# Altium project Assignment2.PrjPcb (part 1 of 2)
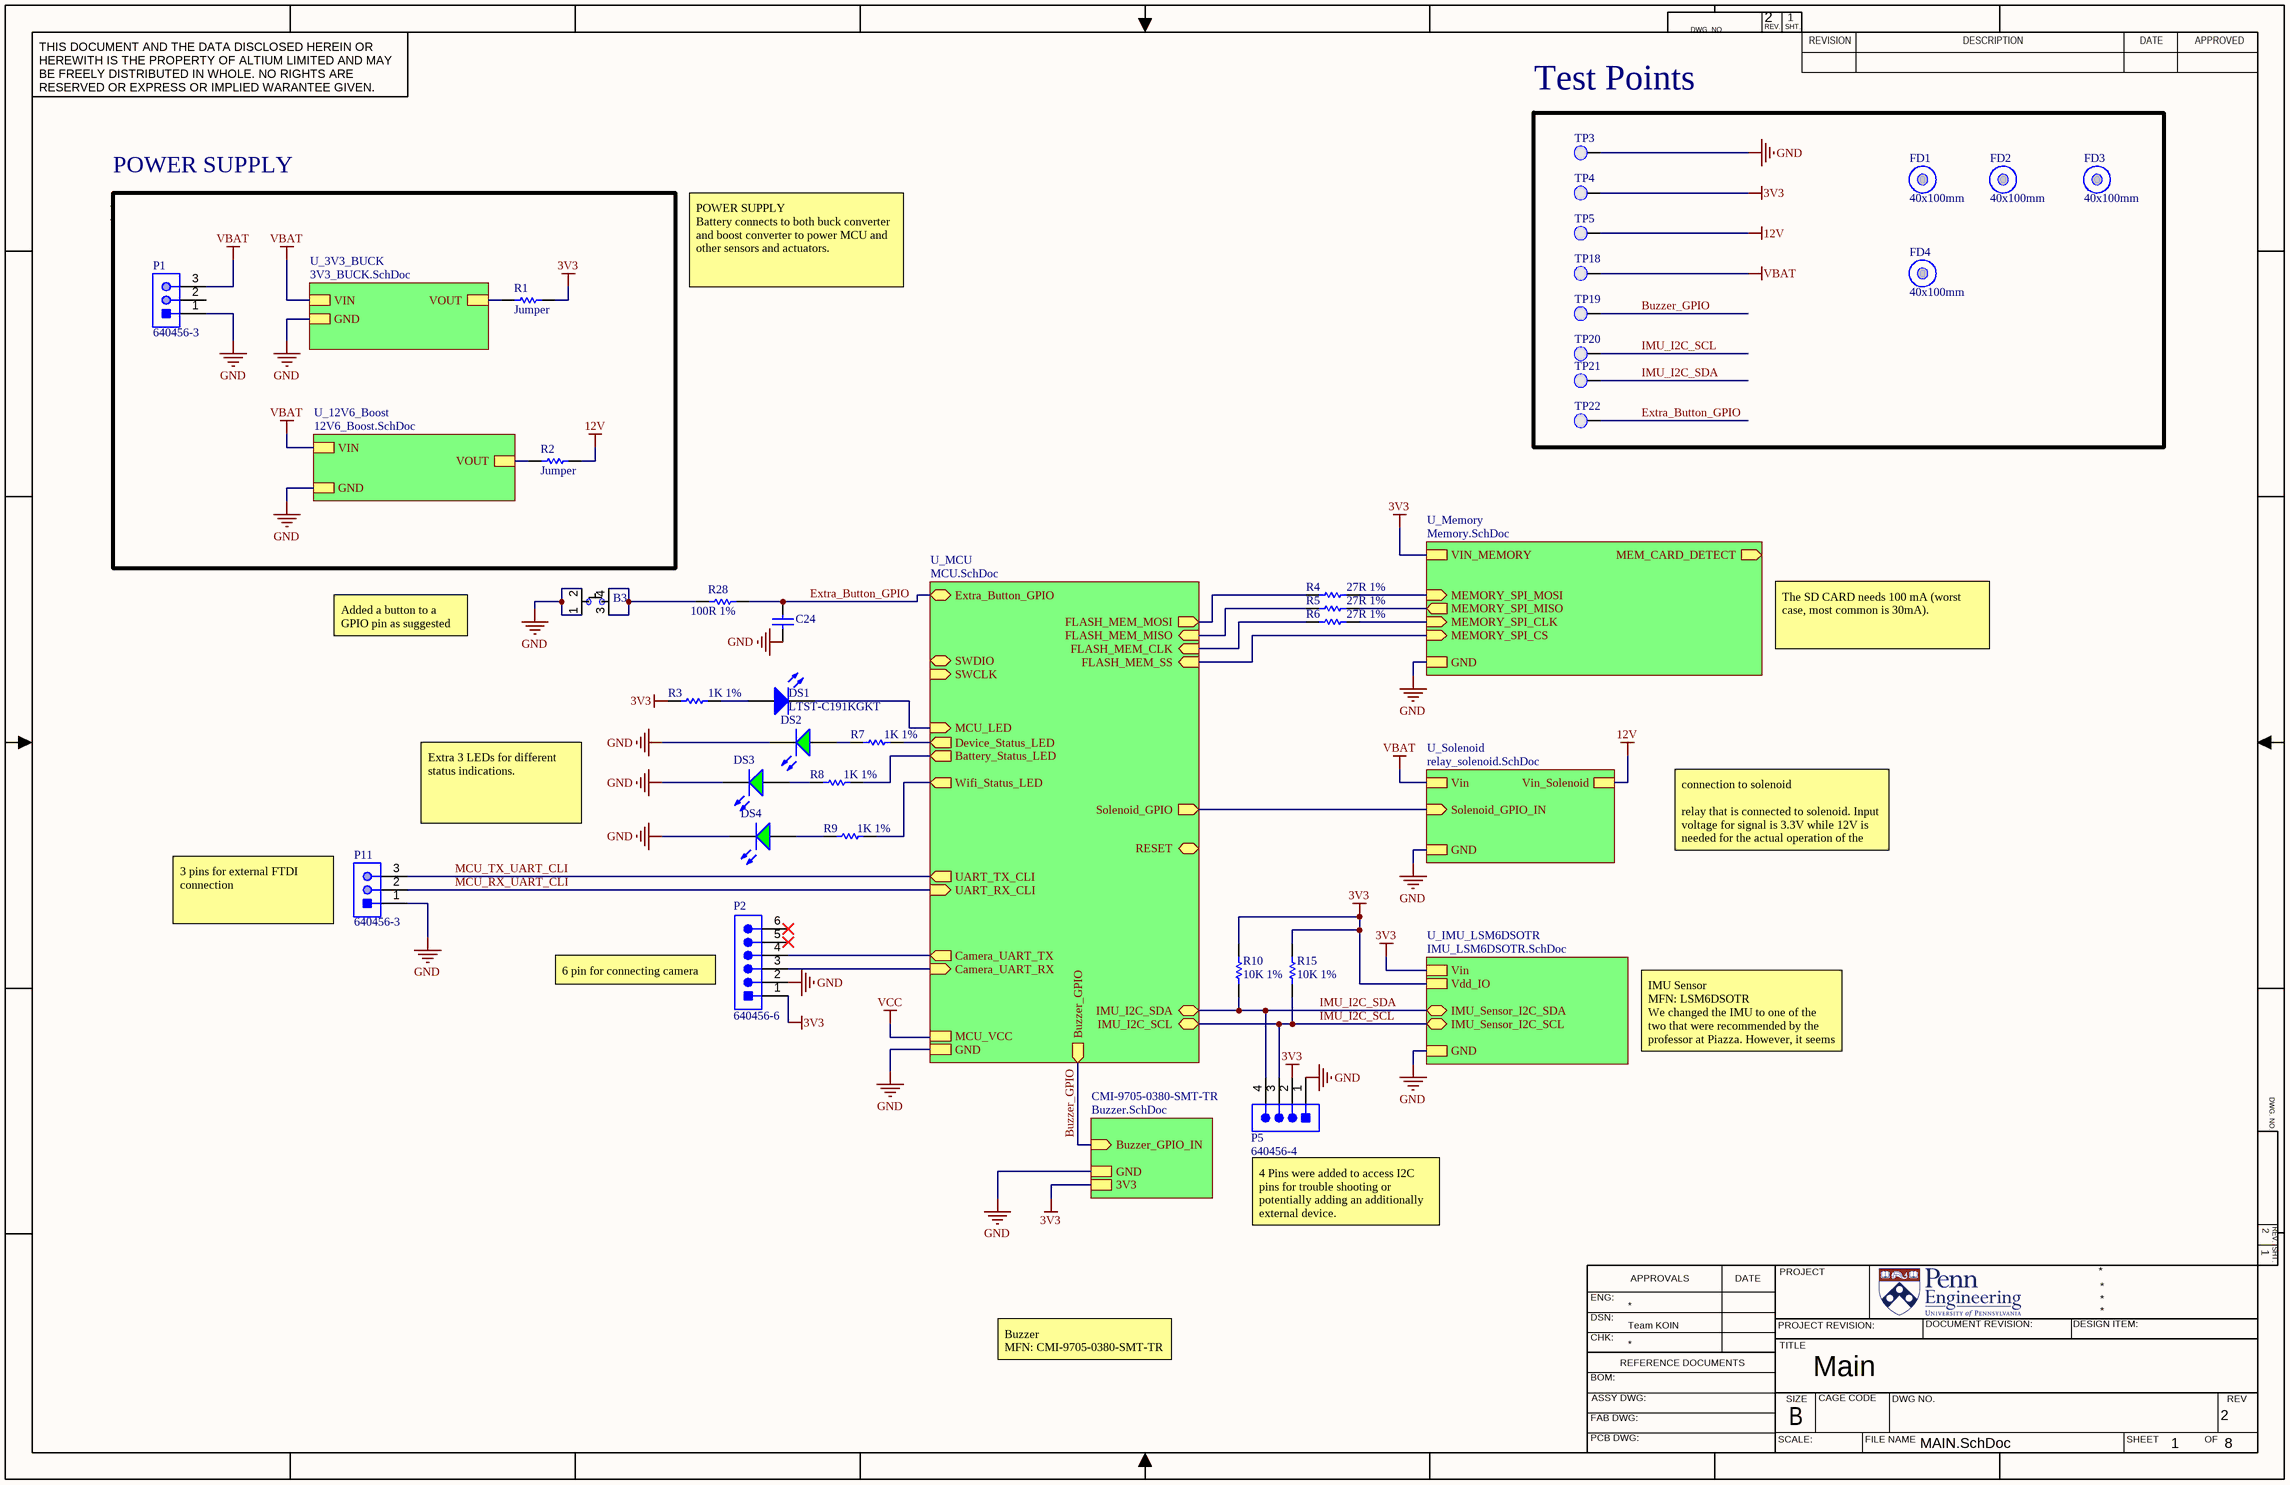
[diagram p0: MAIN.SchDoc]
8 sheets, 107 parts. Net scope: strictly hierarchical (ports join the sheet entries above them; power ports are local).
Board file: ESE516_PCB.PcbDoc
Sheets:
  MAIN.SchDoc
    U_MCU = MCU.SchDoc
    U_Memory = Memory.SchDoc
    U_3V3_BUCK = 3V3_BUCK.SchDoc
    U_12V6_Boost = 12V6_Boost.SchDoc
    U_Solenoid = relay_solenoid.SchDoc
    U_IMU_LSM6DSOTR = IMU_LSM6DSOTR.SchDoc
    CMI-9705-0380-SMT-TR = Buzzer.SchDoc

## Sheet MAIN.SchDoc: Main
size 431 x 279 mm; Date: 02/15/2021; CompanyName: University of Pennsylvania; DrawnBy: Team KOIN; DocumentNumber: 1; Revision: 2; SheetNumber: 1; SheetTotal: 8

### Parts
B3  PTS810 SJK 250 SMTR LFS  [PTS810 SJK 250 SMTR LFS]  (value not drawn)
C24  CAP 1uF 16V 0603(1608)  [CAPC0603(1608)100_N]  (value not drawn)
DS1  LTST-C191KGKT  [LITE-ON-LTST-C191KRKT-2_V]
DS2  (no value)  [LTST-C170GKT_V]
DS3  (no value)  [LTST-C170GKT_V]
DS4  (no value)  [LTST-C170GKT_V]
FD1  40x100mm  [Fiducial_FT]
FD2  40x100mm  [Fiducial_FT]
FD3  40x100mm  [Fiducial_FT]
FD4  40x100mm  [Fiducial_FT]
P1  640456-3  [TECO-640456-3]
P2  640456-6  [TECO-640456-6_V]
P5  640456-4  [TECO-640456-4]
P11  640456-3  [TECO-640456-3]
R1  Jumper  [RESC0805(2012)_N]
R2  Jumper  [RESC0805(2012)_N]
R3  1K 1%  [RESC0603(1608)_N]
R4  27R 1%  [RESC0603(1608)_N]
R5  27R 1%  [RESC0603(1608)_N]
R6  27R 1%  [RESC0603(1608)_N]
R7  1K 1%  [RESC0603(1608)_M]
R8  1K 1%  [RESC0603(1608)_M]
R9  1K 1%  [RESC0603(1608)_M]
R10  10K 1%  [RESC0603(1608)_N]
R15  10K 1%  [RESC0603(1608)_N]
R28  100R 1%  [RESC0603(1608)_N]
TP3  0.1" Pad  [PCBComponent]  (value not drawn)
TP4  0.1" Pad  [PCBComponent]  (value not drawn)
TP5  0.1" Pad  [PCBComponent]  (value not drawn)
TP18  0.1" Pad  [PCBComponent]  (value not drawn)
TP19  0.1" Pad  [PCBComponent]  (value not drawn)
TP20  0.1" Pad  [PCBComponent]  (value not drawn)
TP21  0.1" Pad  [PCBComponent]  (value not drawn)
TP22  0.1" Pad  [PCBComponent]  (value not drawn)

### Blocks framed on the sheet
Test Points: FD1-FD4 TP3-TP5 TP18-TP22

### Sub-sheets
CMI-9705-0380-SMT-TR = Buzzer.SchDoc: Buzzer_GPIO_IN (in), 3V3, GND
U_3V3_BUCK = 3V3_BUCK.SchDoc: VOUT, VIN, GND
U_12V6_Boost = 12V6_Boost.SchDoc: VOUT, VIN, GND
U_IMU_LSM6DSOTR = IMU_LSM6DSOTR.SchDoc: Vin, GND, IMU_Sensor_I2C_SCL (bidir), IMU_Sensor_I2C_SDA (bidir), Vdd_IO
U_MCU = MCU.SchDoc: SWDIO (bidir), SWCLK (in), UART_TX_CLI (out), UART_RX_CLI (in), FLASH_MEM_SS (in), FLASH_MEM_CLK (in), FLASH_MEM_MISO (in), FLASH_MEM_MOSI (out), RESET (bidir), MCU_LED (in), MCU_VCC, GND, IMU_I2C_SCL (bidir), IMU_I2C_SDA (bidir), Camera_UART_RX (in), Camera_UART_TX (out), Device_Status_LED (out), Battery_Status_LED (out), Wifi_Status_LED (out), Buzzer_GPIO (out), Solenoid_GPIO (out), Extra_Button_GPIO (bidir)
U_Memory = Memory.SchDoc: VIN_MEMORY, MEMORY_SPI_MOSI (in), MEMORY_SPI_MISO (out), MEMORY_SPI_CLK (in), MEMORY_SPI_CS (in), MEM_CARD_DETECT (out), GND
U_Solenoid = relay_solenoid.SchDoc: Solenoid_GPIO_IN (in), Vin, GND, Vin_Solenoid

### Nets
3V3: P2.1 P5.2 R1.2 R3.1 R10.2 R15.2 TP4.1(PAD) ; sheet U_Memory/VIN_MEMORY, sheet U_IMU_LSM6DSOTR/Vin, sheet U_IMU_LSM6DSOTR/Vdd_IO, sheet CMI-9705-0380-SMT-TR/3V3
12V: R2.2 TP5.1(PAD) ; sheet U_Solenoid/Vin_Solenoid
GND: B3.1 B3.2 C24.1 DS2.2(K) DS3.2(K) DS4.2(K) P1.1 P2.2 P5.1 P11.1 TP3.1(PAD) ; sheet U_MCU/GND, sheet U_Memory/GND, sheet U_3V3_BUCK/GND, sheet U_12V6_Boost/GND, sheet U_Solenoid/GND, sheet U_IMU_LSM6DSOTR/GND, sheet CMI-9705-0380-SMT-TR/GND
VBAT: P1.3 TP18.1(PAD) ; sheet U_3V3_BUCK/VIN, sheet U_12V6_Boost/VIN, sheet U_Solenoid/Vin
Battery_Status_LED: R8.1 ; sheet U_MCU/Battery_Status_LED
Buzzer_GPIO: TP19.1(PAD) ; sheet U_MCU/Buzzer_GPIO, sheet CMI-9705-0380-SMT-TR/Buzzer_GPIO_IN
Camera_SERCOM3_UART_RX: P2.3 ; sheet U_MCU/Camera_UART_RX
Camera_SERCOM3_UART_TX: P2.4 ; sheet U_MCU/Camera_UART_TX
Device_Status_LED: R7.1 ; sheet U_MCU/Device_Status_LED
Extra_Button_GPIO: C24.2 R28.2 TP22.1(PAD) ; sheet U_MCU/Extra_Button_GPIO
FLASH_MEM_SPI_SS: sheet U_MCU/FLASH_MEM_SS, sheet U_Memory/MEMORY_SPI_CS
IMU_I2C_SCL: P5.3 R15.1 TP20.1(PAD) ; sheet U_MCU/IMU_I2C_SCL, sheet U_IMU_LSM6DSOTR/IMU_Sensor_I2C_SCL
IMU_I2C_SDA: P5.4 R10.1 TP21.1(PAD) ; sheet U_MCU/IMU_I2C_SDA, sheet U_IMU_LSM6DSOTR/IMU_Sensor_I2C_SDA
MCU_LED: DS1.2(K) ; sheet U_MCU/MCU_LED
MCU_RX_UART_CLI: P11.2 ; sheet U_MCU/UART_RX_CLI
MCU_TX_UART_CLI: P11.3 ; sheet U_MCU/UART_TX_CLI
MEM_SPI_CLK: R6.2 ; sheet U_Memory/MEMORY_SPI_CLK
MEM_SPI_MISO: R5.2 ; sheet U_Memory/MEMORY_SPI_MISO
MEM_SPI_MOSI: R4.2 ; sheet U_Memory/MEMORY_SPI_MOSI
SERCOM1_PAD2_SPI_MISO: R5.1 ; sheet U_MCU/FLASH_MEM_MISO
SERCOM1_PAD2_SPI_MOSI: R4.1 ; sheet U_MCU/FLASH_MEM_MOSI
SERCOM1_PAD3_SPI_SCK: R6.1 ; sheet U_MCU/FLASH_MEM_CLK
Solenoid_GPIO: sheet U_MCU/Solenoid_GPIO, sheet U_Solenoid/Solenoid_GPIO_IN
VOUT: R2.1 ; sheet U_12V6_Boost/VOUT
VOUT_TPS62: R1.1 ; sheet U_3V3_BUCK/VOUT
Wifi_Status_LED: R9.2 ; sheet U_MCU/Wifi_Status_LED
NetB3_3: B3.3 B3.4 R28.1
NetDS1_1: DS1.1(A) R3.2
NetDS2_1: DS2.1(A) R7.2
NetDS3_1: DS3.1(A) R8.2
NetDS4_1: DS4.1(A) R9.1

Not connected (* = marked no-connect by the designer): P1 2; P2 5* 6*

### Notes on the sheet
- POWER SUPPLY
- POWER SUPPLY
  Battery connects to both buck converter and boost converter to power MCU and other sensors and actuators.
- Added a button to a GPIO pin as suggested by the professor
- The SD CARD needs 100 mA (worst case, most common is 30mA).
- Extra 3 LEDs for different status indications.
- connection to solenoid
  relay that is connected to solenoid. Input voltage for signal is 3.3V while 12V is needed for the actual operation of the solenoid. (Please check the realy_solenoid.SchDoc for the details)
- (near P11) 3 pins for external FTDI connection
- (near P2) 6 pin for connecting camera
- IMU Sensor
  MFN: LSM6DSOTR
  We changed the IMU to one of the two that were recommended by the professor at Piazza. However, it seems it is out-of-stock (both recommended IMUs are out-of-stock)
- 4 Pins were added to access I2C pins for trouble shooting or potentially adding an additionally external device.
- Buzzer
  MFN: CMI-9705-0380-SMT-TR
- DWG. NO.
- REV.
- SHT.
- THIS DOCUMENT AND THE DATA DISCLOSED HEREIN OR HEREWITH IS THE PROPERTY OF ALTIUM LIMITED AND MAY BE FREELY DISTRIBUTED IN WHOLE. NO RIGHTS ARE RESERVED OR EXPRESS OR IMPLIED WARANTEE GIVEN.
- REVISION
- DESCRIPTION
- DATE
- APPROVED
- ENG:
- APPROVALS
- PROJECT
- DSN:
- CHK:
- REFERENCE DOCUMENTS
- PROJECT REVISION:
- TITLE
- DOCUMENT REVISION:
- DESIGN ITEM:
- BOM:
- FAB DWG:
- PCB DWG:
- ASSY DWG:
- SCALE:
- SIZE
- B
- CAGE CODE
- FILE NAME
- DWG NO.
- SHEET
- OF
- REV

### Library data of the parts
B3 = PTS810 SJK 250 SMTR LFS: SWITCH TACTILE SPST-NO 0.05A 16V Tactile Switch SPST-NO Top Actuated Surface Mount; Manufacturer: ITT /  C&K Components; Part # Aliases: Y97LT25B5DBFP; Operating Force: 2.6 N; Actuator: Oval; Current Rating: 50 mA; Voltage Rating DC: 16 VDC; Contact Form: SPST; Switch Function: OFF - (ON); Mounting Direction: Straight; Stem Height: 2.5 mm; Brand: C&K Components; Travel: 0.15 mm; Manufacturer Part Number: PTS810SJK250SMTRLFS; Product Category: Tactile Switches; RoHS: Details; Termination Style: J Form Lead; Mounting Style: SMD/SMT; Color: White; Packaging: Reel; Contact Plating: Silver; Operating Temperature Range: - 40 C to + 85 C; Series: PTS810; Factory Pack Quantity: 2900; ComponentLink1URL: https://datasheet.ciiva.com/18514/pts810-4mar13-18514061.pdf; ComponentLink1Description: https://datasheet.ciiva.com/18514/pts810-4mar13-18514061.pdf; ComponentLink2URL: https://datasheet.ciiva.com/18514/pts810-4mar13-18514062.pdf; ComponentLink2Description: https://datasheet.ciiva.com/18514/pts810-4mar13-18514062.pdf; ComponentLink3URL: https://datasheet.ciiva.com/18514/pts810-4mar13-18514063.pdf; ComponentLink3Description: https://datasheet.ciiva.com/18514/pts810-4mar13-18514063.pdf; Supplier 1: Digi-Key; Supplier Part Number 1: CKN10503CT-ND
C24 = CMP-1035-02736-1: CAP 1uF 16V ±5% 0603 (1608 Metric) Thickness 1mm SMD; Case-Metric: 1608; Case-EIA: 0603; Tolerance: Â±5%; Technology: SMT; Max Thickness: 1 mm; Rated Voltage: 16 V; Value: 1uF
DS1 = CMP-2000-05198-1: Chip LED, Green, 574 nm, 40 pF, -55 to 85 degC, 2-Pin SMD, RoHS, Tape and Reel; Manufacturer: Lite-On; Rad Hardened: No; Emitting Color: YellowGreen; Product Height (mm): 0.55mm; Forward Voltage: 2.4V; Number of Elements: 1; Dominant Wave Length: 571nm; DELETED: Compliant; Viewing Angle: 130deg; High Brightness: Yes; Peak Wavelength: 574nm; Type: Uni-Color; Forward Current: 30mA; Product Length (mm): 1.6mm; Luminous Intensity: 35mcd; Test Current (It): 20mA; Chip Material: AlGaInP; Product Depth (mm): 0.8mm; Shape Type: Rectangular; Reverse Voltage: 5V; Power Dissipation: 75W; Pin Count: 2; Lens Dimensions: 1.1X0.8X0.37mm; Packaging: TapeandReel; Main Category: ChipLED; Operating Temperature Classification: Industrial; Package Type: ChipLed; Mounting: SurfaceMount; Lum Intensity: 35mcd; Operating Temp Range: -55Cto85C; Datasheet Version: Jan-07; Datasheet URL: http://download.siliconexpert.com/pdfs/2007/08/26/semi_b/manual/lot/ds/ltst-c191kgkt.pdf; Manufacturer URL: http://www.us.liteon.com/
DS2-DS4 = CMP-1674-00002-5: LED Uni-Color Green, 100 mW, 120 mA, -55 to 85 degC, 2-Pin SMD, RoHS, Tape and Reel; Manufacturer: Lite-On; ComponentLink1URL: http://www.us.liteon.com/; Height: 1.1 mm; PackageDescription: 2-Pin Surface Mount Device, Body 2 x 1.25 mm; RoHSCompliant: true; Package Quantity: 1; Packaging: Tape and Reel; Mount: Surface Mount; Min Operating Temperature: -55 degC; DatasheetVersion: 03/2003; Max Operating Temperature: 85 degC; ComponentLink1Description: Manufacturer URL; Pins: 2; Mounting Technology: Surface Mount; Length: 2 mm; Colour: Green; PackageReference: C170GKT; ComponentLink2URL: http://media.digikey.com/pdf/Data%20Sheets/Lite-On%20PDFs/LTST-C170GKT.pdf; ComponentLink2Description: Datasheet
FD1-FD4 = CMP-00174-A.4: Fiducial 40x100mm
P1 P11 = CMP-2000-05418-1: Male Header, Pitch 2.54 mm, 1 x 3 Position, Height 10.03 mm, Tail Length 3.56 mm, -55 to 105 degC; Manufacturer: TE Connectivity; Agency Approvals: CSA,UL; Angle: Straight; Number of Positions: 3; Standards: RoHSCompliant,ELVCompliant,UL94V-0; Current, Rating: 5 / A; Connector Type: MTA-100; Mount Angle: Vertical; Material, Housing: Polyester; Temperature, Operating: -55to+105 / degC; Voltage, Rating: 250 / V; Color, Housing: White; Contact Centerline Spacing: 0.100 / in.; Special Features: Pinstrip; Material, Contact: CopperAlloy; Contact Termination Area Plating: Tin; Primary Type: InterconnectSystem; Pin Spacing: 0.1 / "; Brand/Series: MTA-100Series; Mounting Hole Size: 0.04 / "; Manufacturer URL: http://www.te.com/; Datasheet URL: https://datasheet.ciiva.com/16456/eng-ds-82056-mta-0608-16456886.pdf; Flammability Rating: UL94V-0; Mounting Type: PCMount; Contact Mating Area Plating: Tin; Datasheet Version: Jun-08; Number of Rows: 1; Termination: Solder; Type: PCBPlug; Length, Pin: 0.14 / "; Color: White; Contact Plating: Tin; Contact Shape: Square; Number of Contacts: 3; Size, Post: 0.025 / in.; Length, Terminal Post: 0.14 / in.; Length, Overall: 0.3 / "
P2 = CMP-2000-05661-1: Male Header, Pitch 2.54 mm, 1 x 6 Position, Height 10.03 mm, Tail Length 3.56 mm, -55 to 105 degC, Bulk; Manufacturer: TE Connectivity; Contact Centerline Spacing: 0.100 / in.; Number of Contacts: 6; Current, Rating: 5 / A; Agency Approvals: CSA,UL; Material, Contact: CopperAlloy; Brand/Series: MTA-100Series; Mount Angle: Vertical; Contact Termination Area Plating: Tin; Angle: Straight; Primary Type: InterconnectSystem; Standards: RoHSCompliant,ELVCompliant,UL94V-0; Temperature, Operating: -55to+105 / °C; Material, Housing: Polyester; Special Features: Pinstrip; Color, Housing: White; Connector Type: MTA-100; Voltage, Rating: 250 / V; Termination: Solder; Package Reference: 640456-6; Size, Post: 0.025 / in.; Color: White; Datasheet URL: https://datasheet.ciiva.com/25618/0900766b80eb7fdd-25618163.pdf; Manufacturer URL: http://www.te.com/; Mounting Type: PCMount; Type: PCBPlug; Mounting Technology: ThroughHole; Number of Rows: 1; Contact Shape: Square; Contact Mating Area Plating: Tin; Datasheet Version: Rev. W, 05/2005; Number of Positions: 6; Package Description: Male Header, Pitch 2.54 mm, 1 x 6 Position, Height 10.03 mm, Tail Length 3.56 mm; Contact Plating: Tin; Length, Terminal Post: 0.14 / in.; Flammability Rating: UL94V-0
P5 = CMP-2000-05419-1: Male Header, Pitch 2.54 mm, 1 x 4 Position, Height 10.03 mm, Tail Length 3.56 mm, RoHS, Bulk; Manufacturer: TE Connectivity; Material, Housing: Polyester; Primary Type: InterconnectSystem; Mount Angle: Vertical; Color, Housing: White; Current, Rating: 5 / A; Agency Approvals: CSA,UL; Contact Termination Area Plating: Tin; Temperature, Operating: -55to+105 / degC; Standards: RoHSCompliant,ELVCompliant,UL94V-0; Number of Positions: 4; Brand/Series: MTA-100Series; Angle: Straight; Pin Spacing: 0.1 / "; Material, Contact: CopperAlloy; Connector Type: MTA-100; Special Features: Pinstrip; Mounting Hole Size: 0.04 / "; Contact Centerline Spacing: 0.100 / in.; Voltage, Rating: 250 / V; Manufacturer URL: http://www.te.com/; Length, Pin: 0.14 / "; Length, Overall: 0.4 / "; Color: White; Flammability Rating: UL94V-0; Mounting Type: PCMount; Termination: Solder; Datasheet URL: https://datasheet.ciiva.com/16286/eng-ds-82056-mta-0608-16286228.pdf; Number of Contacts: 4; Contact Shape: Square; Contact Mating Area Plating: Tin; Length, Terminal Post: 0.14 / in.; Size, Post: 0.025 / in.; Contact Plating: Tin; Type: PCBPlug; Datasheet Version: Dec-14; Number of Rows: 1
R1 R2 = CMP-1013-00001-1: Jumper 0805 (2012 Metric); Case-EIA: 0805; Value: 0.00 Ohm; Tolerance: None; Case-Metric: 2012; Technology: SMT; Power: None
R3 R7-R9 = CMP-1012-00510-1: 1K 0.1W 1% 0603 (1608 Metric)  SMD; Case-Metric: 1608; Case-EIA: 0603; Value: 1000.00 Ohm; Technology: SMT; Tolerance: 1 %; Power: 0.1 W
R4-R6 = CMP-1012-00331-1: 27R 0.1W 1% 0603 (1608 Metric)  SMD; Case-EIA: 0603; Value: 27.00 Ohm; Case-Metric: 1608; Technology: SMT; Tolerance: 1 %; Power: 0.1 W
R10 R15 = CMP-1012-00623-1: 10K 0.1W 1% 0603 (1608 Metric)  SMD; Value: 10000.00 Ohm; Case-EIA: 0603; Case-Metric: 1608; Power: 0.1 W; Tolerance: 1 %; Technology: SMT
R28 = CMP-1012-00397-1: 100R 0.1W 1% 0603 (1608 Metric)  SMD; Value: 100.00 Ohm; Case-EIA: 0603; Case-Metric: 1608; Technology: SMT; Tolerance: 1 %; Power: 0.1 W
TP3-TP5 TP18-TP22 = 0.1" Pad-A.4

## Sheet MCU.SchDoc: MCU
size 431 x 279 mm; Date: 02/15/2021; DrawnBy: Team KOIN; Organization: university of Pennsylvania; DocumentNumber: 2; Revision: 4; SheetNumber: 5; SheetTotal: 9
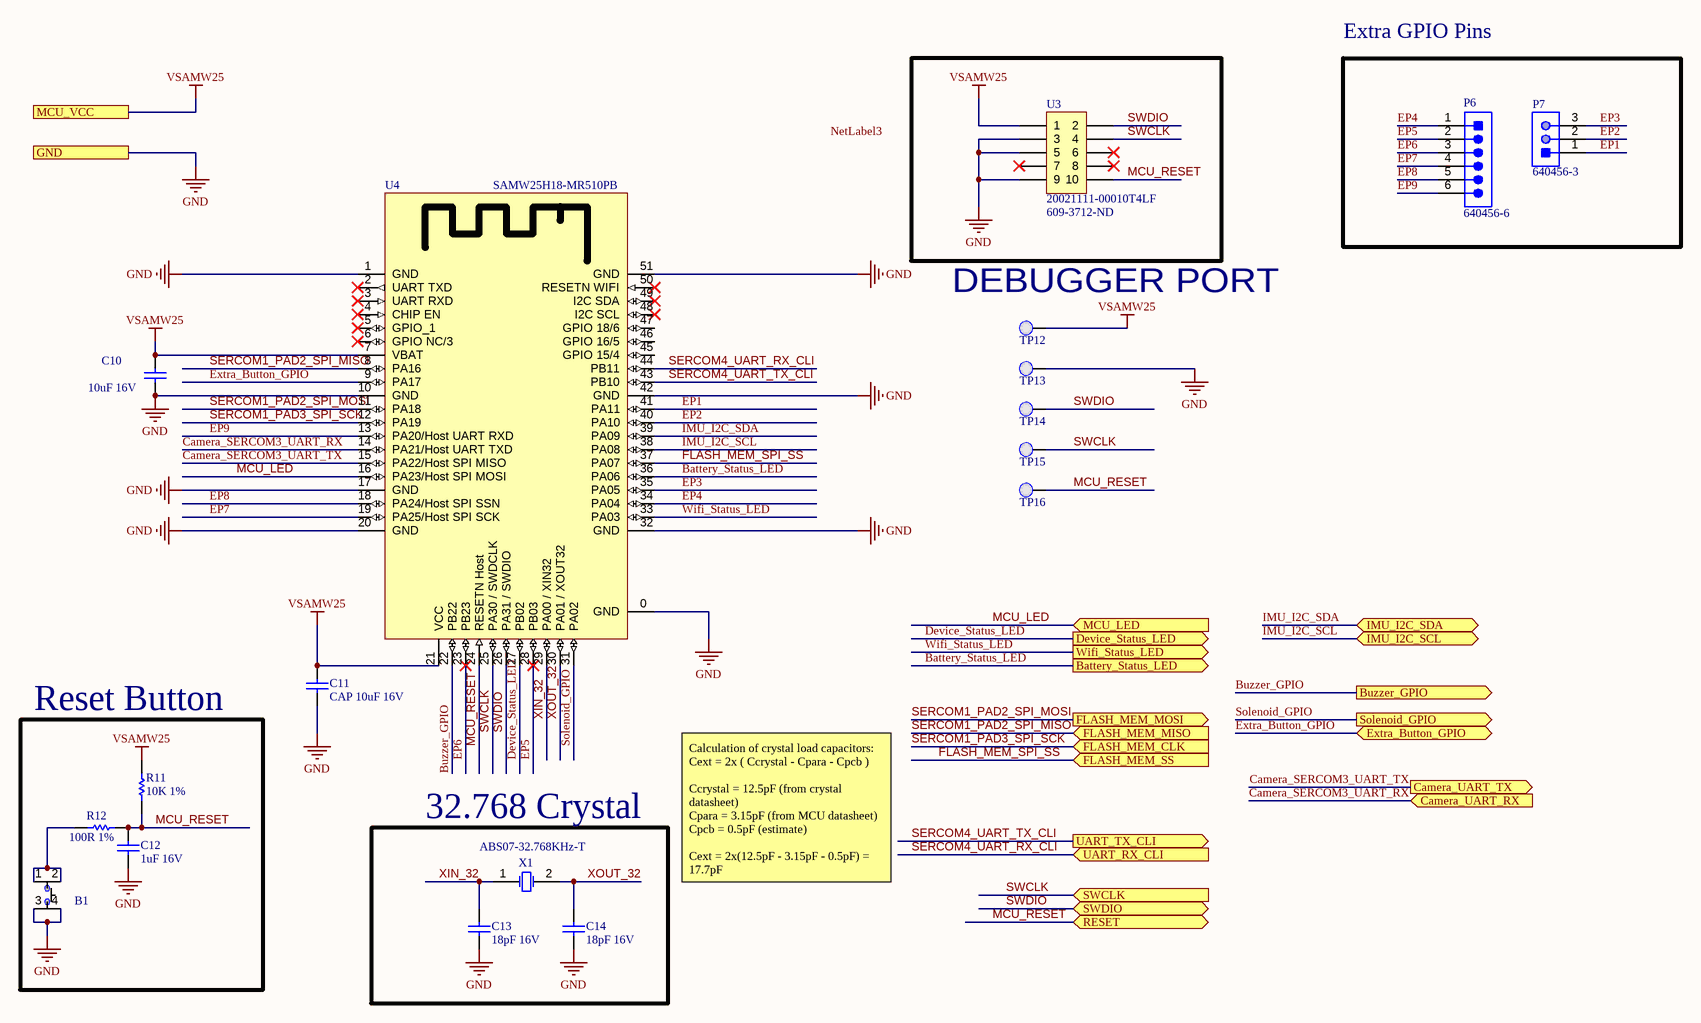
[diagram p1: MCU.SchDoc]

### Parts
B1  PTS810 SJK 250 SMTR LFS  [PTS810 SJK 250 SMTR LFS]  (value not drawn)
C10  10uF 16V  [CAPC0805(2012)145_N]
C11  CAP 10uF 16V  [CAPC0805(2012)145_N]
C12  1uF 16V  [CAPC0603(1608)100_N]
C13  18pF 16V  [CAPC0603(1608)100_N]
C14  18pF 16V  [CAPC0603(1608)100_N]
P6  640456-6  [TECO-640456-6_V]
P7  640456-3  [TECO-640456-3]
R11  10K 1%  [RESC0603(1608)_N]
R12  100R 1%  [RESC0603(1608)_N]
TP12  0.1" Pad  [PCBComponent]  (value not drawn)
TP13  0.1" Pad  [PCBComponent]  (value not drawn)
TP14  0.1" Pad  [PCBComponent]  (value not drawn)
TP15  0.1" Pad  [PCBComponent]  (value not drawn)
TP16  0.1" Pad  [PCBComponent]  (value not drawn)
U3  20021111-00010T4LF  Supplier Part Number 1: 609-3712-ND  [20021111-00010T4LF]
U4  SAMW25H18-MR510PB  [SAMW25H18-MR510PB]
X1  ABS07-32.768KHz-T  [ABRA-ABS07-2_V]

### Blocks framed on the sheet
Extra GPIO Pins: P6 P7
Reset Button: B1 C12 R11 R12
32.768 Crystal: C13 C14 X1

### Ports
Battery_Status_LED (out), Buzzer_GPIO (out), Camera_UART_RX (in), Camera_UART_TX (out), Device_Status_LED (out), Extra_Button_GPIO (bidir), FLASH_MEM_CLK (in), FLASH_MEM_MISO (in), FLASH_MEM_MOSI (out), FLASH_MEM_SS (in), GND, IMU_I2C_SCL (bidir), IMU_I2C_SDA (bidir), MCU_LED (in), MCU_VCC, RESET (bidir), Solenoid_GPIO (out), SWCLK (in), SWDIO (bidir), UART_RX_CLI (in), UART_TX_CLI (out), Wifi_Status_LED (out)

### Nets
GND: B1.3 B1.4 C10.1 C11.1 C12.1 C13.1 C14.1 TP13.1(PAD) U3.3 U3.5 U3.9 U4.0(GND) U4.1(GND) U4.10(GND) U4.17(GND) U4.20(GND) U4.32(GND) U4.42(GND) U4.51(GND) ; port GND
VSAMW25: C10.2 C11.2 R11.2 TP12.1(PAD) U3.1 U4.7(VBAT) U4.21(VCC) ; port MCU_VCC
Battery_Status_LED: U4.36(PA06) ; port Battery_Status_LED
Buzzer_GPIO: U4.22(PB22) ; port Buzzer_GPIO
Camera_SERCOM3_UART_RX: U4.14(PA21/Host_UART_TXD) ; port Camera_UART_RX
Camera_SERCOM3_UART_TX: U4.15(PA22/Host_SPI_MISO) ; port Camera_UART_TX
Device_Status_LED: U4.27(PB02) ; port Device_Status_LED
EP1: P7.1 U4.41(PA11)
EP2: P7.2 U4.40(PA10)
EP3: P7.3 U4.35(PA05)
EP4: P6.1 U4.34(PA04)
EP5: P6.2 U4.28(PB03)
EP6: P6.3 U4.23(PB23)
EP7: P6.4 U4.19(PA25/Host_SPI_SCK)
EP8: P6.5 U4.18(PA24/Host_SPI_SSN)
EP9: P6.6 U4.13(PA20/Host_UART_RXD)
Extra_Button_GPIO: U4.9(PA17) ; port Extra_Button_GPIO
FLASH_MEM_SPI_SS: U4.37(PA07) ; port FLASH_MEM_SS
IMU_I2C_SCL: U4.38(PA08) ; port IMU_I2C_SCL
IMU_I2C_SDA: U4.39(PA09) ; port IMU_I2C_SDA
MCU_LED: U4.16(PA23/Host_SPI_MOSI) ; port MCU_LED
MCU_RESET: C12.2 R11.1 R12.2 TP16.1(PAD) U3.10 U4.24(RESETN_Host) ; port RESET
SERCOM1_PAD2_SPI_MISO: U4.8(PA16) ; port FLASH_MEM_MISO
SERCOM1_PAD2_SPI_MOSI: U4.11(PA18) ; port FLASH_MEM_MOSI
SERCOM1_PAD3_SPI_SCK: U4.12(PA19) ; port FLASH_MEM_CLK
SERCOM4_UART_RX_CLI: U4.44(PB11) ; port UART_RX_CLI  [project net MCU_RX_UART_CLI]
SERCOM4_UART_TX_CLI: U4.43(PB10) ; port UART_TX_CLI  [project net MCU_TX_UART_CLI]
Solenoid_GPIO: U4.31(PA02) ; port Solenoid_GPIO
SWCLK: TP15.1(PAD) U3.4 U4.25(PA30_/_SWDCLK) ; port SWCLK
SWDIO: TP14.1(PAD) U3.2 U4.26(PA31_/_SWDIO) ; port SWDIO
Wifi_Status_LED: U4.33(PA03) ; port Wifi_Status_LED
XIN_32: C13.2 U4.29(PA00_/_XIN32) X1.1(X1)
XOUT_32: C14.2 U4.30(PA01_/_XOUT32) X1.2(X2)
NetB1_1: B1.1 B1.2 R12.1

Not connected (* = marked no-connect by the designer): U3 6* 7* 8*; U4 2(UART_TXD)* 3(UART_RXD)* 4(CHIP_EN)* 5(GPIO_1)* 6(GPIO_NC/3)* 45(GPIO_15/4) 46(GPIO_16/5) 47(GPIO_18/6) 48(I2C_SCL)* 49(I2C_SDA)* 50(RESETN_WIFI)*

### Notes on the sheet
- (near TP12) DEBUGGER PORT
- Calculation of crystal load capacitors:
  Cext = 2x ( Ccrystal - Cpara - Cpcb )
  Ccrystal = 12.5pF (from crystal datasheet)
  Cpara = 3.15pF (from MCU datasheet)
  Cpcb = 0.5pF (estimate)
  Cext = 2x(12.5pF - 3.15pF - 0.5pF) = 17.7pF
- Labels drawn without touching a wire or pin: NetLabel3
- DWG. NO.
- REV.
- SHT.
- THIS DOCUMENT AND THE DATA DISCLOSED HEREIN OR HEREWITH IS THE PROPERTY OF ALTIUM LIMITED AND MAY BE FREELY DISTRIBUTED IN WHOLE. NO RIGHTS ARE RESERVED OR EXPRESS OR IMPLIED WARANTEE GIVEN.
- REVISION
- DESCRIPTION
- DATE
- APPROVED
- ENG:
- APPROVALS
- PROJECT
- DSN:
- CHK:
- REFERENCE DOCUMENTS
- PROJECT REVISION:
- TITLE
- DOCUMENT REVISION:
- DESIGN ITEM:
- BOM:
- FAB DWG:
- PCB DWG:
- ASSY DWG:
- SCALE:
- SIZE
- B
- CAGE CODE
- FILE NAME
- DWG NO.
- SHEET
- OF
- REV

### Library data of the parts
B1 = PTS810 SJK 250 SMTR LFS: as B3 on sheet MAIN; Manufacturer Part Number: PTS810SJK250SMTRLFS; Product Category: Tactile Switches; RoHS: Details; Termination Style: J Form Lead; Mounting Style: SMD/SMT; Color: White; Packaging: Reel; Contact Plating: Silver; Operating Temperature Range: - 40 C to + 85 C; Series: PTS810; Factory Pack Quantity: 2900; ComponentLink1URL: https://datasheet.ciiva.com/18514/pts810-4mar13-18514061.pdf; ComponentLink1Description: https://datasheet.ciiva.com/18514/pts810-4mar13-18514061.pdf; ComponentLink2URL: https://datasheet.ciiva.com/18514/pts810-4mar13-18514062.pdf; ComponentLink2Description: https://datasheet.ciiva.com/18514/pts810-4mar13-18514062.pdf; ComponentLink3URL: https://datasheet.ciiva.com/18514/pts810-4mar13-18514063.pdf; ComponentLink3Description: https://datasheet.ciiva.com/18514/pts810-4mar13-18514063.pdf; Supplier 1: Digi-Key; Supplier Part Number 1: CKN10503CT-ND
C10 C11 = CMP-1036-04927-1: CAP 10uF 16V ±10% 0805 (2012 Metric) Thickness 1.45mm SMD; Case-EIA: 0805; Tolerance: Â±10%; Case-Metric: 2012; Rated Voltage: 16 V; Technology: SMT; Value: 10uF; Max Thickness: 1.45 mm
C12 = CMP-1035-02736-1: as C24 on sheet MAIN; Technology: SMT; Max Thickness: 1 mm; Rated Voltage: 16 V; Value: 1uF
C13 C14 = CMP-1035-00738-1: CAP 18pF 16V ±5% 0603 (1608 Metric) Thickness 1mm SMD; Tolerance: Â±5%; Case-EIA: 0603; Case-Metric: 1608; Max Thickness: 1 mm; Rated Voltage: 16 V; Value: 18pF; Technology: SMT
P6 = CMP-2000-05661-1: Male Header, Pitch 2.54 mm, 1 x 6 Position, Height 10.03 mm, Tail Length 3.56 mm, -55 to 105 degC, Bulk; Manufacturer: TE Connectivity; Contact Centerline Spacing: 0.100 / in.; Number of Contacts: 6; Current, Rating: 5 / A; Agency Approvals: CSA,UL; Material, Contact: CopperAlloy; Mounting Hole Size: 0.04 / "; Brand/Series: MTA-100Series; Pin Spacing: 0.1 / "; Mount Angle: Vertical; Contact Termination Area Plating: Tin; Angle: Straight; Primary Type: InterconnectSystem; Standards: RoHSCompliant,ELVCompliant,UL94V-0; Temperature, Operating: -55to+105 / °C; Material, Housing: Polyester; Special Features: Pinstrip; Color, Housing: White; Connector Type: MTA-100; Voltage, Rating: 250 / V; Termination: Solder; Package Reference: 640456-6; Size, Post: 0.025 / in.; Color: White; Datasheet URL: https://datasheet.ciiva.com/25618/0900766b80eb7fdd-25618163.pdf; Manufacturer URL: http://www.te.com/; Mounting Type: PCMount; Length, Pin: 0.14 / "; Type: PCBPlug; Length, Overall: 0.6 / "; Mounting Technology: ThroughHole; Number of Rows: 1; Contact Shape: Square; Contact Mating Area Plating: Tin; Datasheet Version: Rev. W, 05/2005; Number of Positions: 6; Package Description: Male Header, Pitch 2.54 mm, 1 x 6 Position, Height 10.03 mm, Tail Length 3.56 mm; Contact Plating: Tin; Length, Terminal Post: 0.14 / in.; Flammability Rating: UL94V-0
P7 = CMP-2000-05418-1: as P1 on sheet MAIN; Manufacturer URL: http://www.te.com/; Datasheet URL: https://datasheet.ciiva.com/16456/eng-ds-82056-mta-0608-16456886.pdf; Flammability Rating: UL94V-0; Mounting Type: PCMount; Contact Mating Area Plating: Tin; Datasheet Version: Jun-08; Number of Rows: 1; Termination: Solder; Type: PCBPlug; Length, Pin: 0.14 / "; Color: White; Contact Plating: Tin; Contact Shape: Square; Number of Contacts: 3; Size, Post: 0.025 / in.; Length, Terminal Post: 0.14 / in.; Length, Overall: 0.3 / "
R11 = CMP-1012-00623-1: as R10 on sheet MAIN; Power: 0.1 W; Tolerance: 1 %; Technology: SMT
R12 = CMP-1012-00397-1: as R28 on sheet MAIN; Technology: SMT; Tolerance: 1 %; Power: 0.1 W
TP12-TP16 = 0.1" Pad-A.4
U3 = 20021111-00010T4LF: CONN HEADER 10POS UNSHD VERT T/H; Manufacturer: Amphenol / FCI; Stack Height: 2.5 mm; Number of Positions / Contacts: 10; Brand: FCI; Pitch: 1.27 mm; Mounting Angle: Vertical; Current Rating: 10 A; Mating Post Length: 3.05 mm; Voltage Rating: 125 V; Manufacturer Part Number: 20021111-00010T4LF; Mounting Style: Through Hole; Product Category: Headers & Wire Housings; RoHS: Details; Series: Minitek; Product Type: Headers; Type: Unshrouded; Number of Positions: 10; Number of Rows: 2; Contact Plating: Gold; Housing Material: Plastic; Termination Style: Through Hole; Contact Material: Nickel; Packaging: Tube; Factory Pack Quantity: 93; Termination Post Length: 2.3 mm; ComponentLink1URL: https://datasheet.ciiva.com/1433/1079612-1433267.pdf; ComponentLink1Description: https://datasheet.ciiva.com/1433/1079612-1433267.pdf; ComponentLink2URL: https://datasheet.ciiva.com/409/20021111-409158.pdf; ComponentLink2Description: https://datasheet.ciiva.com/409/20021111-409158.pdf; ComponentLink3URL: https://datasheet.ciiva.com/5131/20021111-5131386.pdf; ComponentLink3Description: https://datasheet.ciiva.com/5131/20021111-5131386.pdf; ComponentLink4URL: https://datasheet.ciiva.com/9465/20021111-9465402.pdf; ComponentLink4Description: https://datasheet.ciiva.com/9465/20021111-9465402.pdf; Supplier 1: Digi-Key
U4 = SAMW25H18-MR510PB: RF TXRX MODULE WIFI TRACE ANT; Manufacturer: Atmel; Manufacturer Part Number: ATSAMW25H18-MR510PB; Protocol: 802.11b/g/n; Frequency: 2.4GHz; Data Rate: 65Mbps; Power - Output: 17dBm; Sensitivity: -95.5dBm; Serial Interfaces: SPI, UART; Antenna Type: Integrated, Trace; Memory Size: 256kB Flash, 32kB SRAM; Voltage - Supply: 2.7 V ~ 4.2 V; Category: RF/IF and RFID; Family: RF Transceiver Modules; Series: Xplained Pro; Packaging: Tray; RF Family/Standard: WiFi; Modulation: -; Current - Receiving: -; Current - Transmitting: -; Mounting Type: Surface Mount; Operating Temperature: -40°C ~ 85°C; Package / Case: Module; ComponentLink1URL: http://www.atmel.com/devices/ATSAMW25.aspx; ComponentLink1Description: http://www.atmel.com/devices/ATSAMW25.aspx; ComponentLink2URL: http://www.farnell.com/datasheets/1965115.pdf; ComponentLink2Description: http://www.farnell.com/datasheets/1965115.pdf; Supplier 1: Digikey; Stock 1: 120; Pricing 1: 1=19.14 (USD); Supplier Part Number 1: ATSAMW25H18-MR510PB-ND
X1 = CMP-0447-00001-2: Crystal, 32.768 kHz, 12.5 pF, -40 to 85 degC, SMD Low Profile 3.2 x 1.5 x 0.9 mm, Tape and Reel; Manufacturer: Abracon; Q Value (Type): 30000; Operation Mode: Flexural Mode (Tuning Fork); Shunt Capacitance (C0): 0.9 to 1.2 pF; Load Capacitance (CL): 12.5 pF; Frequency Tolerance @+25degC: +/- 20 ppm; Drive Level (Type): 0.1 uW; Equivalent Series Resistance (R1): 70 Kohm; Insulation Resistance (Min): 500 Mohm; ComponentLink3URL: http://www.abracon.com/Resonators/ABS07.pdf; PackageDescription: 2-Pin Hand Drawn, Body 3.2x1.5mm, Pitch 2.5mm; Operating Temperature: -40 to 85 degC; ComponentLink2URL: http://www.abracon.com/Resonators/ABS07.pdf; PackageReference: ABS07-2; ComponentLink3Description: Package Specification; ComponentLink1Description: Manufacturer URL; DatasheetVersion: 04.03.13; Mounting Technology: Surface Mount; ComponentLink2Description: Datasheet; ComponentLink1URL: http://www.abracon.com/; PartNumber: ABS07-32.768KHz-T; Packing: Tape and Reel; Frequency: 32.768 kHz

## Sheet Memory.SchDoc: Memory
size 431 x 279 mm; Date: 02/15/2021; DrawnBy: Team KOIN; DocumentNumber: 2; Revision: 1; SheetNumber: 2; SheetTotal: 9
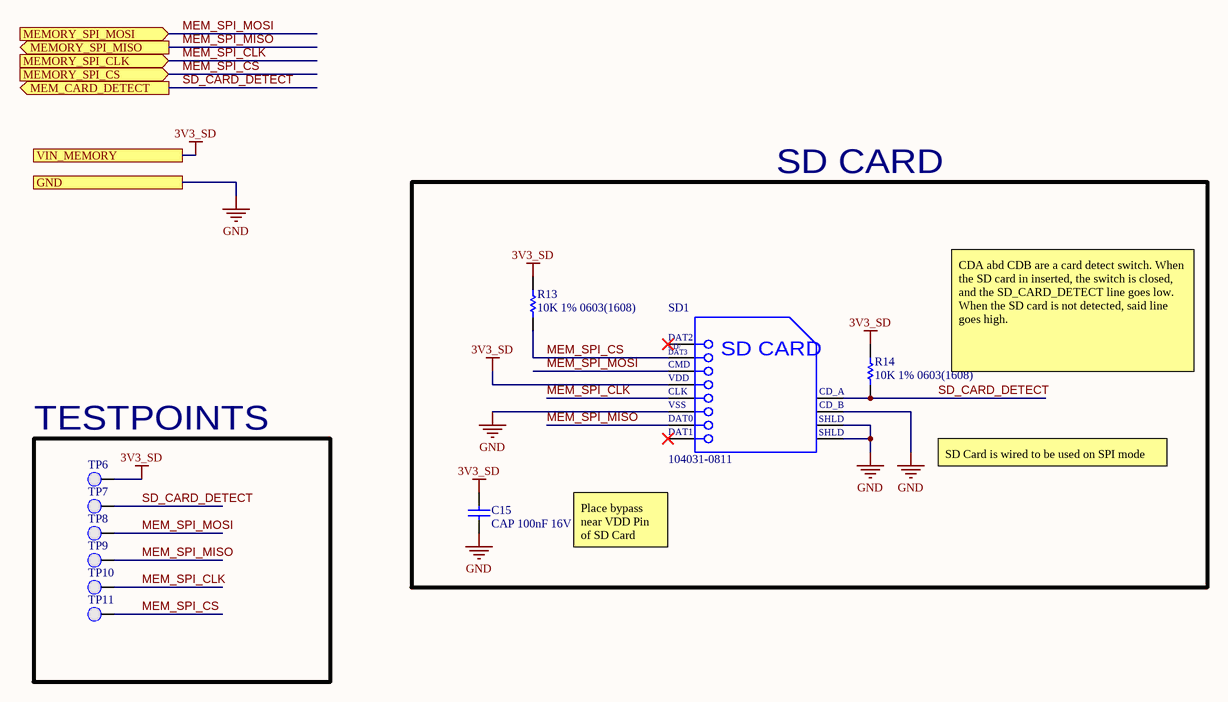
[diagram p2: Memory.SchDoc]

### Parts
C15  CAP 100nF 16V 0603(1608)  [CAPC0603(1608)100_N]
R13  10K 1% 0603(1608)  [RESC0603(1608)_N]
R14  10K 1% 0603(1608)  [RESC0603(1608)_N]
SD1  104031-0811  [MOLX-104031-0811_V]
TP6  0.1" Pad  [PCBComponent]  (value not drawn)
TP7  0.1" Pad  [PCBComponent]  (value not drawn)
TP8  0.1" Pad  [PCBComponent]  (value not drawn)
TP9  0.1" Pad  [PCBComponent]  (value not drawn)
TP10  0.1" Pad  [PCBComponent]  (value not drawn)
TP11  0.1" Pad  [PCBComponent]  (value not drawn)

### Blocks framed on the sheet
SD CARD: C15 R13 R14 SD1
TESTPOINTS: TP6-TP11

### Ports
GND, MEM_CARD_DETECT (out), MEMORY_SPI_CLK (in), MEMORY_SPI_CS (in), MEMORY_SPI_MISO (out), MEMORY_SPI_MOSI (in), VIN_MEMORY

### Nets
3V3_SD: C15.2 R13.2 R14.2 SD1.4(VDD) TP6.1(PAD) ; port VIN_MEMORY  [project net 3V3]
GND: C15.1 SD1.6(VSS2) SD1.10(CD_B) SD1.11(SHLD1) SD1.12(SHLD2) ; port GND
MEM_SPI_CLK: SD1.5(CLK) TP10.1(PAD) ; port MEMORY_SPI_CLK
MEM_SPI_CS: R13.1 SD1.2(CMD) TP11.1(PAD) ; port MEMORY_SPI_CS  [project net FLASH_MEM_SPI_SS]
MEM_SPI_MISO: SD1.7(DAT0) TP9.1(PAD) ; port MEMORY_SPI_MISO
MEM_SPI_MOSI: SD1.3(VSS1) TP8.1(PAD) ; port MEMORY_SPI_MOSI
SD_CARD_DETECT: R14.1 SD1.9(CD_A) TP7.1(PAD) ; port MEM_CARD_DETECT

Not connected (* = marked no-connect by the designer): SD1 1(CD/DAT3)* 8(DAT1)*

### Notes on the sheet
- CDA abd CDB are a card detect switch. When the SD card in inserted, the switch is closed, and the SD_CARD_DETECT line goes low. When the SD card is not detected, said line goes high.
- SD Card is wired to be used on SPI mode
- Place bypass near VDD Pin of SD Card
- DWG. NO.
- REV.
- SHT.
- THIS DOCUMENT AND THE DATA DISCLOSED HEREIN OR HEREWITH IS THE PROPERTY OF ALTIUM LIMITED AND MAY BE FREELY DISTRIBUTED IN WHOLE. NO RIGHTS ARE RESERVED OR EXPRESS OR IMPLIED WARANTEE GIVEN.
- REVISION
- DESCRIPTION
- DATE
- APPROVED
- ENG:
- APPROVALS
- PROJECT
- DSN:
- CHK:
- REFERENCE DOCUMENTS
- PROJECT REVISION:
- TITLE
- DOCUMENT REVISION:
- DESIGN ITEM:
- BOM:
- FAB DWG:
- PCB DWG:
- ASSY DWG:
- SCALE:
- SIZE
- B
- CAGE CODE
- FILE NAME
- DWG NO.
- SHEET
- OF
- REV
- (in symbol CMP-2000-05825-1) DAT2; CD/; DAT3; SD CARD; VSS; SHLD

### Library data of the parts
C15 = CMP-1035-02584-1: CAP 100nF 16V ±10% 0603 (1608 Metric) Thickness 1mm SMD; Tolerance: Â±10%; Case-EIA: 0603; Case-Metric: 1608; Technology: SMT; Max Thickness: 1 mm; Value: 100nF; Rated Voltage: 16 V
R13 R14 = CMP-1012-00623-1: as R10 on sheet MAIN; Power: 0.1 W; Tolerance: 1 %; Technology: SMT
SD1 = CMP-2000-05825-1: Micro SD Card, RA, -25 to 85 degC, 8-Pin SMD, RoHS, Tape and Reel; Voltage Rating: 10VAC/DC; Number of Contacts: 8; Insertion - Extraction Style: Push-Pull; Pitch: 1.1mm; Mating Cycles: 10000; Brand: Molex; Current Rating: 500mA; Manufacturer URL: http://www.molex.com/; Card Type: microSD; Mounting Type: Standard; Height: 1.42mm; Mounting Technology: SurfaceMount; Contact Plating: Gold; Product Category: MemoryCardConnectors; Package Description: 8-Pin Surface Mount Device, Body 11.95 x 11.4 mm, Pitch 1.1 mm; Datasheet URL: http://www.molex.com/pdm_docs/sd/1040310811_sd.pdf; Termination Style: SMD; Length: 11.4mm; Housing Material: LiquidCrystalPolymer(LCP); Orientation: RightAngle; RoHS: True; Contact Material: PhosphorBronze; Datasheet Version: Rev. E, 04/2006; Packaging: Reel; Manufacturer: Molex; Series: 104031; Product: CardConnectors; Number of Rows: 1Row; Package Reference: 104031-0811
TP6-TP11 = 0.1" Pad-A.4

## Sheet 3V3_BUCK.SchDoc: 3V3 Buck Converter
size 431 x 279 mm; Date: 02/15/2021; DrawnBy: Team KOIN; Organization: University of Pennsylvania; DocumentNumber: 3; Revision: 2; SheetNumber: 4; SheetTotal: 9
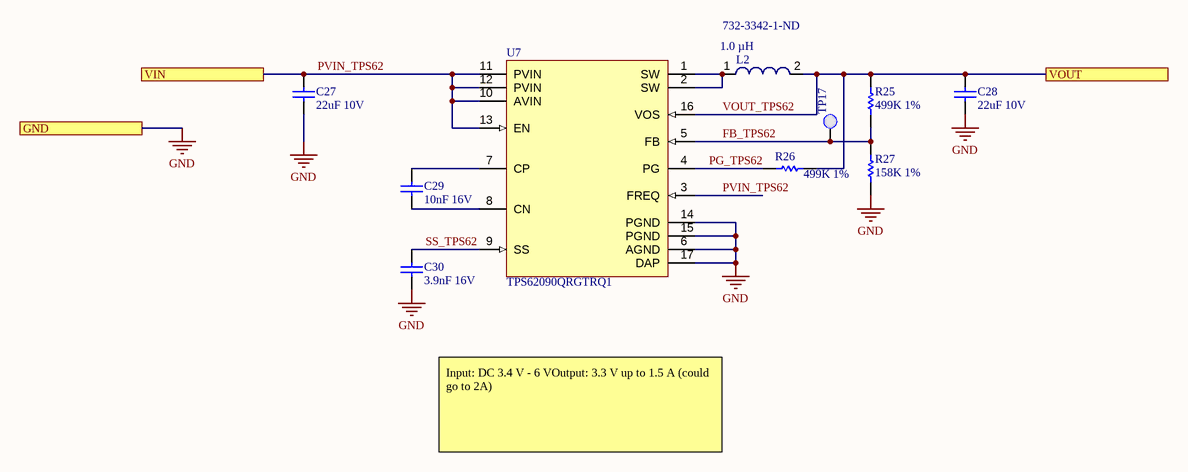
[diagram p3: 3V3_BUCK.SchDoc]

### Parts
C27  22uF 10V  [CAPC0805(2012)145_N]
C28  22uF 10V  [CAPC0805(2012)145_N]
C29  10nF 16V  [CAPC0603(1608)100_N]
C30  3.9nF 16V  [CAPC0603(1608)100_N]
L2  Inductance: 1.0 µH  Supplier Part Number 1: 732-3342-1-ND  [WE-LHMI 4020]  (hidden comment: 74437324010)
R25  499K 1%  [RESC0603(1608)_L]
R26  499K 1%  [RESC0603(1608)_L]
R27  158K 1%  [RESC0603(1608)_N]
TP17  0.1" Pad  [PCBComponent]  (value not drawn)
U7  TPS62090QRGTRQ1  [FP-RGT0016C-IPC_A]

### Ports
GND, VIN, VOUT

### Nets
GND: C27.1 C28.1 C30.1 R27.1 U7.6(AGND) U7.14(PGND) U7.15(PGND) U7.17(DAP) ; port GND
PVIN_TPS62: C27.2 U7.3(FREQ) U7.10(AVIN) U7.11(PVIN) U7.12(PVIN) U7.13(EN) ; port VIN  [project net VBAT]
FB_TPS62: R25.1 R27.2 TP17.1(PAD) U7.5(FB)
PG_TPS62: R26.2 U7.4(PG)
SS_TPS62: C30.2 U7.9(SS)
VOUT_TPS62: C28.2 L2.2 R25.2 R26.1 U7.16(VOS) ; port VOUT
NetC29_1: C29.1 U7.8(CN)
NetC29_2: C29.2 U7.7(CP)
NetL2_1: L2.1 U7.1(SW) U7.2(SW)

### Notes on the sheet
- Input: DC 3.4 V - 6 VOutput: 3.3 V up to 1.5 A (could go to 2A)
- DWG. NO.
- REV.
- SHT.
- THIS DOCUMENT AND THE DATA DISCLOSED HEREIN OR HEREWITH IS THE PROPERTY OF ALTIUM LIMITED AND MAY BE FREELY DISTRIBUTED IN WHOLE. NO RIGHTS ARE RESERVED OR EXPRESS OR IMPLIED WARANTEE GIVEN.
- REVISION
- DESCRIPTION
- DATE
- APPROVED
- ENG:
- APPROVALS
- PROJECT
- DSN:
- CHK:
- REFERENCE DOCUMENTS
- PROJECT REVISION:
- TITLE
- DOCUMENT REVISION:
- DESIGN ITEM:
- BOM:
- FAB DWG:
- PCB DWG:
- ASSY DWG:
- SCALE:
- SIZE
- B
- CAGE CODE
- FILE NAME
- DWG NO.
- SHEET
- OF
- REV

### Library data of the parts
C27 C28 = CMP-1036-04943-1: CAP 22uF 10V ±20% 0805 (2012 Metric) Thickness 1.45mm SMD; Case-Metric: 2012; Case-EIA: 0805; Tolerance: Â±20%; Rated Voltage: 10 V; Max Thickness: 1.45 mm; Technology: SMT; Value: 22uF
C29 = CMP-1035-02311-1: CAP 10nF 16V ±10% 0603 (1608 Metric) Thickness 1mm SMD; Case-EIA: 0603; Case-Metric: 1608; Tolerance: Â±10%; Rated Voltage: 16 V; Value: 10nF; Max Thickness: 1 mm; Technology: SMT
C30 = CMP-1035-02154-1: CAP 3.9nF 16V ±10% 0603 (1608 Metric) Thickness 1mm SMD; Tolerance: Â±10%; Case-Metric: 1608; Case-EIA: 0603; Max Thickness: 1 mm; Technology: SMT; Value: 3.9nF; Rated Voltage: 16 V
L2 = CMP-1353-00030-1: SMD Power Inductor WE-LHMI, L=1.0 µH; Manufacturer: Wuerth Elektronik; Core Material: Ferrite,Composite; Tolerance: 20%; Current Rating: 5A; Saturation Current: 9A; Shielding: Shielded; Frequency: 89MHz; DC Resistance (DCR): 27mR; Test Frequency: 100kHz; ComponentLink1Description: Manufacturer URL; ComponentLink2URL: http://katalog.we-online.de/kataloge/eisos/media/pdf/74437324010.pdf; PartNumber: 74437324010; ComponentLink1URL: http://www.we-online.com; ComponentLink2Description: Datasheet; PackageReference: WE-LHMI 4020; Supplier 1: Digi-Key; Manufacturer Part Number: 74437324010; Stock 1: 1150; Pricing 1: 1=2.20000, 10=2.15000, 50=1.97100, 100=1.88200, 500=1.79200, 1000=1.70200 (USD); RoHS: Yes; Mount: Surface Mount; Case/Package: Nonstandard; Min Operating Temperature: -40°C; Max Operating Temperature: 125°C; Package Quantity: 1; Packaging: Tape and Reel; Self Resonant Frequency: 89MHz; Inductance Tolerance: 20%; Composition: Wirewound; Max DC Current: 5A; Termination: SMD/SMT; RMS Current (Irms): 5A; Series Resistance: 27mR; Length: 4.45mm; Height: 1.8mm; Width: 4.06mm; Height - Seated (Max): 0.079inch; Depth: 4.06mm; REACH SVHC: Unknown; ComponentLink3URL: https://datasheet.ciiva.com/25608/0900766b810c01e4-25608161.pdf?src-supplier=RSComponents; ComponentLink3Description: https://datasheet.ciiva.com/25608/0900766b810c01e4-25608161.pdf?src-supplier=RSComponents; ComponentLink4URL: https://datasheet.ciiva.com/1052/74437324010-1052167.pdf?src-supplier=Digi-Key; ComponentLink4Description: https://datasheet.ciiva.com/1052/74437324010-1052167.pdf?src-supplier=Digi-Key; ComponentLink5URL: https://datasheet.ciiva.com/4961/74437324010-55268-4961274.pdf?src-supplier=Mouser; ComponentLink5Description: https://datasheet.ciiva.com/4961/74437324010-55268-4961274.pdf?src-supplier=Mouser; ComponentLink6URL: https://datasheet.ciiva.com/7892/1735821-7892716.pdf?src-supplier=Element14; ComponentLink6Description: https://datasheet.ciiva.com/7892/1735821-7892716.pdf?src-supplier=Element14; ComponentLink7URL: https://datasheet.ciiva.com/1052/74437324010-1052168.pdf?src-supplier=Digi-Key; ComponentLink7Description: https://datasheet.ciiva.com/1052/74437324010-1052168.pdf?src-supplier=Digi-Key; ComponentLink8URL: https://datasheet.ciiva.com/1052/74437324010-1052169.pdf?src-supplier=Digi-Key; ComponentLink8Description: https://datasheet.ciiva.com/1052/74437324010-1052169.pdf?src-supplier=Digi-Key
R25 R26 = CMP-1012-00815-1: 499K 0.1W 1% 0603 (1608 Metric)  SMD; Value: 499000.00 Ohm; Case-Metric: 1608; Case-EIA: 0603; Tolerance: 1 %; Technology: SMT; Power: 0.1 W
R27 = CMP-1012-00756-1: 158K 0.1W 1% 0603 (1608 Metric)  SMD; Value: 158000.00 Ohm; Case-Metric: 1608; Case-EIA: 0603; Tolerance: 1 %; Technology: SMT; Power: 0.1 W
TP17 = 0.1" Pad-A.4
U7 = TPS62090QRGTRQ1: IC REG BUCK; Vendor: Texas Instruments; Built_By: Texas_Instrument_Team; Manufacturer_Part_Number: TPS62090QRGTRQ1; Copyright: Copyright (C) 2018 Accelerated Designs. All rights reserved; RefDes: RefDes; Type: DEV; Value: Value; PartNumber: TPS62090QRGTRQ1; PackageReference: RGT0016C; MountType: SMT; CompType: IC; RoHS: Y; Manufacturer: Texas Instruments

## Sheet 12V6_Boost.SchDoc: 12V6 Boost circuit
size 431 x 279 mm; Date: 02/15/2021; DrawnBy: Team Koin; Organization: University of Pennsylvania; DocumentNumber: 5; Revision: 2; SheetNumber: 6; SheetTotal: 9
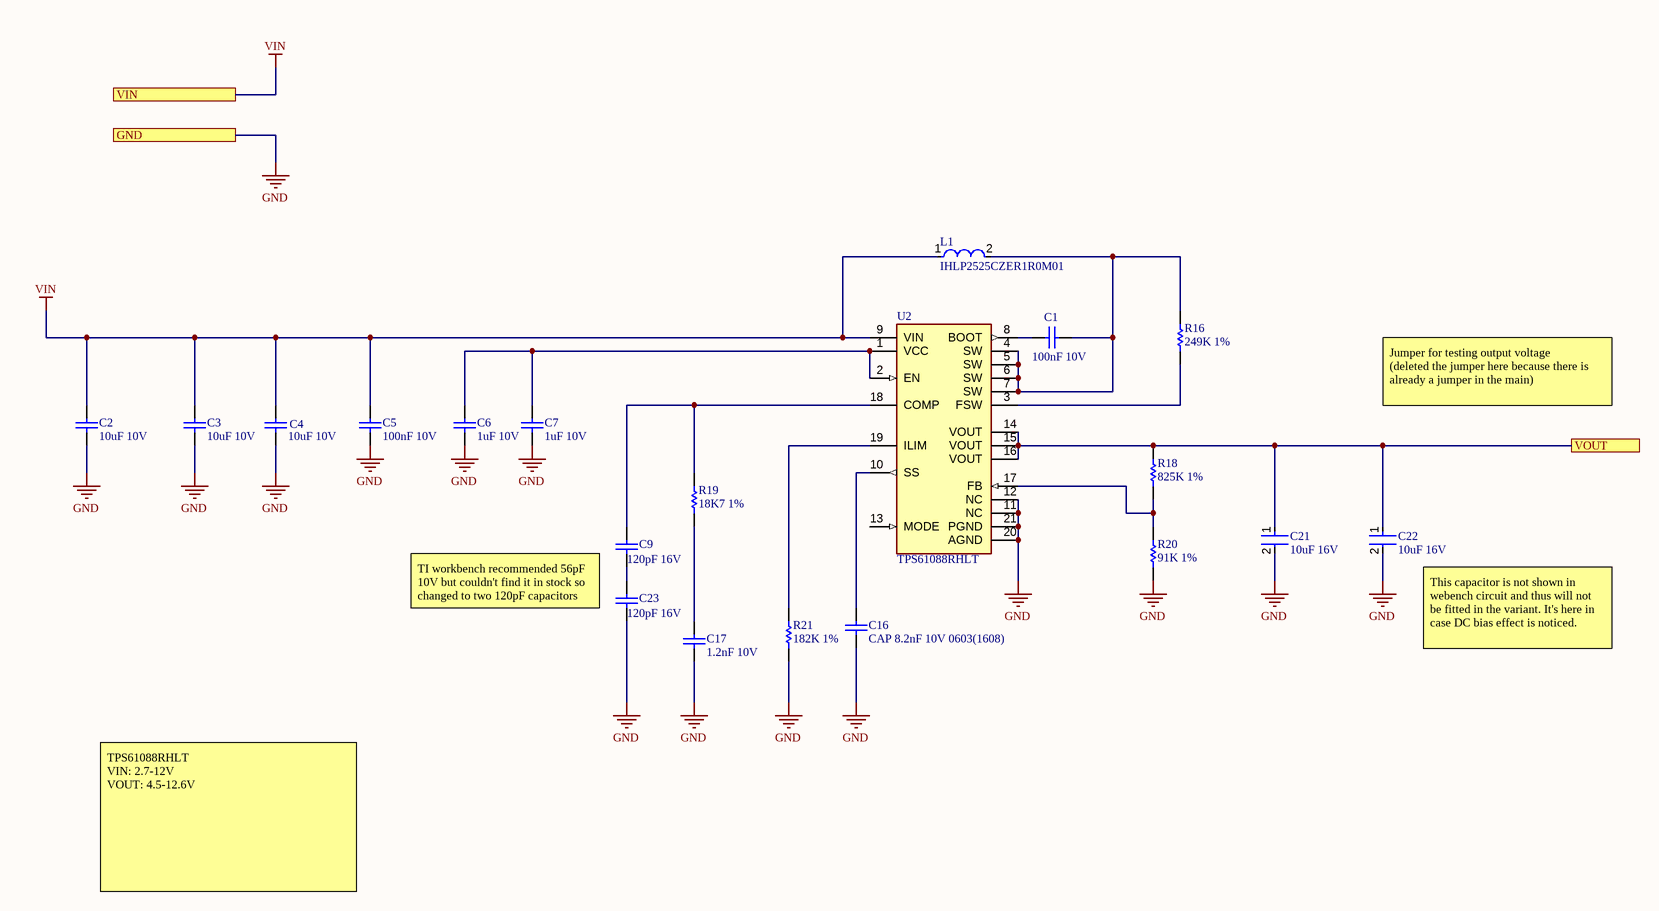
[diagram p4: 12V6_Boost.SchDoc]

### Parts
C1  100nF 10V  [CAPC0603(1608)100_L]
C2  10uF 10V  [CAPC0603(1608)100_N]
C3  10uF 10V  [CAPC0603(1608)100_N]
C4  10uF 10V  [CAPC0603(1608)100_N]
C5  100nF 10V  [CAPC0603(1608)100_L]
C6  1uF 10V  [CAPC0603(1608)100_M]
C7  1uF 10V  [CAPC0603(1608)100_M]
C9  120pF 16V  [CAPC0402(1005)60_N]
C16  CAP 8.2nF 10V 0603(1608)  [CAPC0603(1608)100_N]
C17  1.2nF 10V  [CAPC0603(1608)100_L]
C21  10uF 16V  [FP-CL21-IPC_B]
C22  10uF 16V  [FP-CL21-IPC_B]
C23  120pF 16V  [CAPC0402(1005)60_N]
L1  IHLP2525CZER1R0M01  [FP-IHLP-2525CZ-FP_2_413x3-MFG]
R16  249K 1%  [RESC0603(1608)_L]
R18  825K 1%  [RESC0402(1005)_N]
R19  18K7 1%  [RESC0603(1608)_L]
R20  91K 1%  [RESC0402(1005)_M]
R21  182K 1%  [RESC0603(1608)_L]
U2  TPS61088RHLT  [FP-RHL0020A-MFG]

### Ports
GND, VIN, VOUT

### Nets
GND: C2.1 C3.1 C4.1 C5.1 C6.1 C7.1 C16.2 C17.1 C21.2 C22.2 C23.1 R20.1 R21.1 U2.11(NC) U2.12(NC) U2.20(AGND) U2.21(PGND) ; port GND
VIN: C2.2 C3.2 C4.2 C5.2 L1.1 U2.9(VIN) ; port VIN  [project net VBAT]
VOUT: C21.1 C22.1 R18.2 U2.14(VOUT) U2.15(VOUT) U2.16(VOUT) ; port VOUT
NetC1_1: C1.1 L1.2 R16.2 U2.4(SW) U2.5(SW) U2.6(SW) U2.7(SW)
NetC1_2: C1.2 U2.8(BOOT)
NetC6_2: C6.2 C7.2 U2.1(VCC) U2.2(EN)
NetC9_1: C9.1 C23.2
NetC9_2: C9.2 R19.2 U2.18(COMP)
NetC16_1: C16.1 U2.10(SS)
NetC17_2: C17.2 R19.1
NetR16_1: R16.1 U2.3(FSW)
NetR18_1: R18.1 R20.2 U2.17(FB)
NetR21_2: R21.2 U2.19(ILIM)

Not connected (* = marked no-connect by the designer): U2 13(MODE)

### Notes on the sheet
- Jumper for testing output voltage
  (deleted the jumper here because there is already a jumper in the main)
- TI workbench recommended 56pF 10V but couldn't find it in stock so changed to two 120pF capacitors
- (near C22) This capacitor is not shown in webench circuit and thus will not be fitted in the variant. It's here in case DC bias effect is noticed.
- TPS61088RHLT
  VIN: 2.7-12V
  VOUT: 4.5-12.6V
- DWG. NO.
- REV.
- SHT.
- THIS DOCUMENT AND THE DATA DISCLOSED HEREIN OR HEREWITH IS THE PROPERTY OF ALTIUM LIMITED AND MAY BE FREELY DISTRIBUTED IN WHOLE. NO RIGHTS ARE RESERVED OR EXPRESS OR IMPLIED WARANTEE GIVEN.
- REVISION
- DESCRIPTION
- DATE
- APPROVED
- ENG:
- APPROVALS
- PROJECT
- DSN:
- CHK:
- REFERENCE DOCUMENTS
- PROJECT REVISION:
- TITLE
- DOCUMENT REVISION:
- DESIGN ITEM:
- BOM:
- FAB DWG:
- PCB DWG:
- ASSY DWG:
- SCALE:
- SIZE
- B
- CAGE CODE
- FILE NAME
- DWG NO.
- SHEET
- OF
- REV

### Library data of the parts
C1 = CMP-1035-02579-1: CAP 100nF 10V ±5% 0603 (1608 Metric) Thickness 1mm SMD; Tolerance: Â±5%; Case-EIA: 0603; Case-Metric: 1608; Value: 100nF; Max Thickness: 1 mm; Rated Voltage: 10 V; Technology: SMT
C2-C4 = CMP-1035-02799-1: CAP 10uF 10V ±10% 0603 (1608 Metric) Thickness 1mm SMD; Tolerance: Â±10%; Case-Metric: 1608; Case-EIA: 0603; Max Thickness: 1 mm; Technology: SMT; Rated Voltage: 10 V; Value: 10uF
C5 = CMP-1035-02579-1: Tolerance: Â±5%; Case-EIA: 0603; Case-Metric: 1608; Value: 100nF; Max Thickness: 1 mm; Rated Voltage: 10 V; Technology: SMT
C6 C7 = CMP-1035-02733-1: CAP 1uF 10V ±10% 0603 (1608 Metric) Thickness 1mm SMD; Tolerance: Â±10%; Case-EIA: 0603; Case-Metric: 1608; Rated Voltage: 10 V; Max Thickness: 1 mm; Value: 1uF; Technology: SMT
C9 C23 = CMP-1034-01262-1: CAP 120pF 16V ±1% 0402 (1005 Metric) Thickness 0.6mm SMD; Case-Metric: 1005; Case-EIA: 0402; Tolerance: Â±1%; Max Thickness: 0.6 mm; Value: 120pF; Rated Voltage: 16 V; Technology: SMT
C16 = CMP-1035-02280-1: CAP 8.2nF 10V ±5% 0603 (1608 Metric) Thickness 1mm SMD; Tolerance: Â±5%; Case-Metric: 1608; Case-EIA: 0603; Max Thickness: 1 mm; Technology: SMT; Rated Voltage: 10 V; Value: 8.2nF
C17 = CMP-1035-01909-1: CAP 1.2nF 10V ±1% 0603 (1608 Metric) Thickness 1mm SMD; Case-EIA: 0603; Case-Metric: 1608; Tolerance: Â±1%; Rated Voltage: 10 V; Technology: SMT; Value: 1.2nF; Max Thickness: 1 mm
C21 C22 = CMP-13271-003194-1: CL21 Series 0805 10uF 16V ±10% Tolerance X5R Multilayer Ceramic Chip Capacitor; Case Code (Imperial): 0805; Max Operating Temperature: 85°C; Capacitance: 10uF; Min Operating Temperature: -55°C; Thickness: 0.053inch; Tolerance: 10%; Dielectric: X5R; Radiation Hardening: No; Height: 1.25mm; Packaging: Tape and Reel; Case/Package: 0805; Width: 0.049inch; Package Quantity: 2000; Voltage Rating: 16V; Depth: 1.25mm; Length: 2mm; Case Code (Metric): 2012; Mount: Surface Mount
L1 = CMP-02424-000599-1: Commercial Inductors, High Saturation Series 1uH 11A 10mΩ 20%; Self Resonant Frequency: 5MHz; Test Frequency: 100kHz; Shielding: Shielded; Core Material: Metal; Saturation Current: 22A; DC Resistance (DCR): 10mR; Current Rating: 11A; Packaging: Tape and Reel; Width: 6.47mm; Number of Pins: 2; Case/Package: 2525; Termination: SMD/SMT; Length: 7.24mm; Height: 3mm; Min Operating Temperature: -55°C; Mount: Surface Mount; Inductance Tolerance: 20%; Max Operating Temperature: 125°C; Military Standard: Not; Max DC Current: 11A; RMS Current (Irms): 11A; Lead Free: Lead Free; Depth: 6.72mm; Tolerance: 20%; Package Quantity: 2000; Radiation Hardening: No; Contact Plating: Tin; Inductance: 1uH
R16 = CMP-1012-00779-1: 249K 0.1W 1% 0603 (1608 Metric)  SMD; Case-Metric: 1608; Case-EIA: 0603; Value: 249000.00 Ohm; Technology: SMT; Power: 0.1 W; Tolerance: 1 %
R18 = CMP-1011-00840-1: 825K 0.063W 1% 0402 (1005 Metric)  SMD; Value: 825000.00 Ohm; Case-Metric: 1005; Case-EIA: 0402; Tolerance: 1 %; Power: 0.063 W; Technology: SMT
R19 = CMP-1012-00652-1: 18K7 0.1W 1% 0603 (1608 Metric)  SMD; Value: 18700.00 Ohm; Case-EIA: 0603; Case-Metric: 1608; Technology: SMT; Power: 0.1 W; Tolerance: 1 %
R20 = CMP-1011-00732-1: 91K 0.063W 1% 0402 (1005 Metric)  SMD; Value: 91000.00 Ohm; Case-EIA: 0402; Case-Metric: 1005; Technology: SMT; Power: 0.063 W; Tolerance: 1 %
R21 = CMP-1012-00764-1: 182K 0.1W 1% 0603 (1608 Metric)  SMD; Case-EIA: 0603; Value: 182000.00 Ohm; Case-Metric: 1608; Power: 0.1 W; Technology: SMT; Tolerance: 1 %
U2 = CMP-04918-000117-1: IC REG BOOST ADJ 10A 20VQFN; Manufacturer: Texas Instruments; Output Voltage: 4.5-12.6V; Max Junction Temp: +125°C; Max Duty Cycle: 90%; Output Type: AdjustableProgrammable; Nominal Supply Current: 1-110uA; Min Supply Voltage: 2.7V; Switching Frequency: 200-2200kHz; Number Of Outputs: 1; Max Supply Voltage: 12V; Manufacturer Part Number: TPS61088RHLT; Digikey Description: IC REG BOOST ADJ 10A 20VQFN; Octopart: https://octopart.com/tps61088rhlt-texas+instruments-57155059; Switching Topology: Boost; Lead Free: Yes; Output Current: 10A; Height: 1mm; Temperature: -40°C to +85°C; Package: RHL0020A; Device Class L3: Voltage Regulators - Switching; RoHS: TRUE; Temperature Range Low: -40°C; Temperature Range High: +85°C; Device Class L1: Integrated Circuits (ICs); Automotive: No; Category: IC; ComponentLink2Description: Datasheet; ComponentLink2URL: http://www.ti.com/lit/ds/symlink/tps61088.pdf; Device Class L2: Power Management ICs

## Sheet relay_solenoid.SchDoc: Solenoid driving circuit
size 431 x 279 mm; Date: 02/15/2021; DrawnBy: Team KOIN; Organization: University of Pennsylvania; DocumentNumber: 6; Revision: 2; SheetNumber: 7; SheetTotal: 8
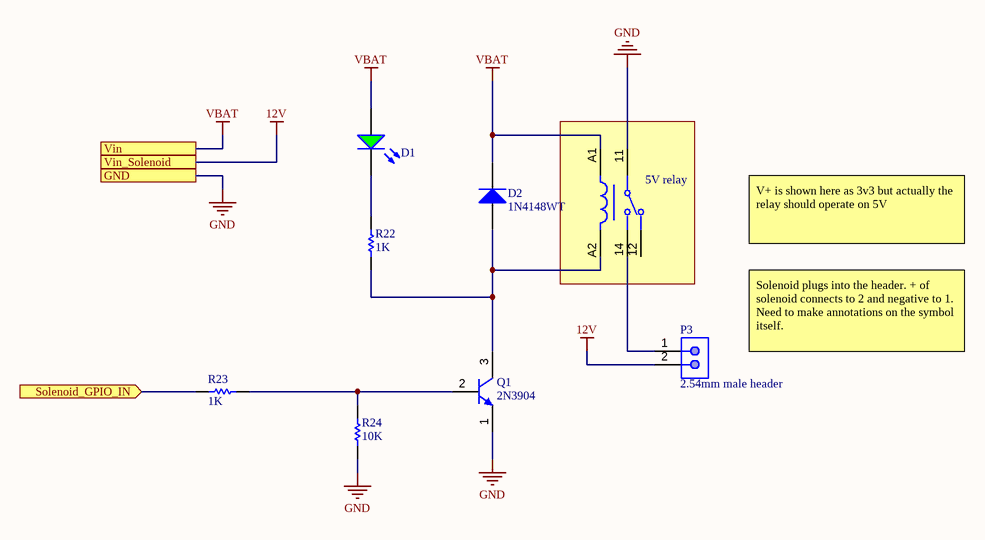
[diagram p5: relay_solenoid.SchDoc]

### Parts
5V_relay  5-1393224-2  [FP-5-1393224-2-MFG]  (value not drawn)
D1  LTST-C170GKT  [LTST-C170GKT_V]  (value not drawn)
D2  1N4148WT  [FAIR-SOD-523F-2_V]
P3  2.54mm male header  [MOLX-22-23-2021_V]
Q1  2N3904  [ONSC-TO-92-3-29-11]
R22  1K  [RESC0603(1608)_M]
R23  1K  [RESC0603(1608)_M]
R24  10K  [RESC0603(1608)_N]

### Ports
GND, Solenoid_GPIO_IN (in), Vin, Vin_Solenoid

### Nets
12V: P3.2 ; port Vin_Solenoid
GND: 5V_relay.11 Q1.1(E) R24.1 ; port GND
VBAT: 5V_relay.A1 D1.1(A) D2.1(K) ; port Vin
Solenoid_GPIO: R23.1 ; port Solenoid_GPIO_IN
Net5V_relay_14: 5V_relay.14 P3.1
Net5V_relay_A2: 5V_relay.A2 D2.2(A) Q1.3(C) R22.1
NetD1_2: D1.2(K) R22.2
NetQ1_2: Q1.2(B) R23.2 R24.2

Not connected (* = marked no-connect by the designer): 5V_relay 12

### Notes on the sheet
- V+ is shown here as 3v3 but actually the relay should operate on 5V
- Solenoid plugs into the header. + of solenoid connects to 2 and negative to 1. Need to make annotations on the symbol itself.
- DWG. NO.
- REV.
- SHT.
- THIS DOCUMENT AND THE DATA DISCLOSED HEREIN OR HEREWITH IS THE PROPERTY OF ALTIUM LIMITED AND MAY BE FREELY DISTRIBUTED IN WHOLE. NO RIGHTS ARE RESERVED OR EXPRESS OR IMPLIED WARANTEE GIVEN.
- REVISION
- DESCRIPTION
- DATE
- APPROVED
- ENG:
- APPROVALS
- PROJECT
- DSN:
- CHK:
- REFERENCE DOCUMENTS
- PROJECT REVISION:
- TITLE
- DOCUMENT REVISION:
- DESIGN ITEM:
- BOM:
- FAB DWG:
- PCB DWG:
- ASSY DWG:
- SCALE:
- SIZE
- B
- CAGE CODE
- FILE NAME
- DWG NO.
- SHEET
- OF
- REV

### Library data of the parts
5V_relay = CMP-03395-000017-1: RELAY GENERAL PURPOSE SPDT 8A 5V; Manufacturer: TE; Coil Power: 223mW; Coil Type: Non-Latching; Number Of Contacts: 1; Coil Resistance: 112Ω; Height: 12.3mm; Device Class L1: Electromechanical; Octopart: https://octopart.com/ry212005-te+connectivity-39636608; Lead Free: Yes; Ambient Temperature Range High: +70°C; Package: 5-1393224-2; Automotive: No; Device Class L3: Power Relays; Current Rating: 8A; ComponentLink2URL: https://www.te.com/usa-en/product-5-1393224-2.html?te_bu=Cor&te_type=other&te_campaign=oct_glo_cor-oct-global-oth-prtnr-fy19-oct-octo-buy-bom_sma-298_2&elqCampaignId=35216; Ambient Temperature Range Low: -40°C; Coil Voltage: 5V; Manufacturer Part Number: 5-1393224-2; Throw Configuration: SPDT; Digikey Description: RELAY GENERAL PURPOSE SPDT 8A 5V; Category: Relay; RoHS: TRUE; Device Class L2: Relays; ComponentLink2Description: Datasheet
D1 = CMP-1674-00002-5: as DS2 on sheet MAIN; PackageReference: C170GKT; ComponentLink1Description: Manufacturer URL; ComponentLink1URL: http://www.us.liteon.com/; Height: 1.1 mm; PackageDescription: 2-Pin Surface Mount Device, Body 2 x 1.25 mm; RoHSCompliant: true; Package Quantity: 1; Packaging: Tape and Reel; Mount: Surface Mount; Min Operating Temperature: -55 degC; DatasheetVersion: 03/2003; Max Operating Temperature: 85 degC; Pins: 2; Mounting Technology: Surface Mount; Length: 2 mm; Colour: Green; ComponentLink2URL: http://media.digikey.com/pdf/Data%20Sheets/Lite-On%20PDFs/LTST-C170GKT.pdf; ComponentLink2Description: Datasheet
D2 = CMP-0881-00001-1: High Conductance Fast Switching Diode, 75 V, -55 to 150 degC, 2-Pin SOD523F, RoHS; Manufacturer: Fairchild Semiconductor; IR (VR: 75 V)=5 uA Max.; VF: 1 V Max.; BVR (IR: 5 uA)=75 V Min.; CO: 4 pF Max.; DatasheetVersion: Rev. A2; ComponentLink1Description: Manufacturer URL; PackageDescription: 2-Pin Surface Mount Device, Body 1.2 x 0.8 mm, Height 0.7 mm; ComponentLink2URL: http://www.fairchildsemi.com/ds/1N/1N4148WT.pdf; ComponentLink2Description: Datasheet; PartNumber: 1N4148WT; ComponentLink1URL: http://www.fairchildsemi.com/; Temperature Range: -55 to 150 degC; Mounting Technology: Surface Mount; PackageReference: SOD-523F-2; RoHS: TRUE
P3 = CMP-1704-00001-1: Male Header, Pitch 2.54 mm, 1 x 2 Position, Height 10.67 mm, Tail Length 3.56 mm, 0 to 75 degC, RoHS, Bulk; Manufacturer: Molex; PackageDescription: Male Header, Pitch 2.54 mm, 1 x 2 Position, Height 10.67 mm, Tail Length 3.56 mm; ComponentLink2URL: https://datasheet.ciiva.com/19454/232266-19454304.pdf; ComponentLink2Description: Datasheet; ComponentLink1Description: Manufacturer URL; PartNumber: 22-23-2021; Mounting Technology: Through Hole; ComponentLink1URL: http://www.molex.com/; PackageReference: 22-23-2021
Q1 = CMP-2000-05562-1: General Purpose Transistor, NPN Silicon, 200 mA, 60 V, -55 to 150 degC, 3-Pin TO-92, RoHS, Bulk; Manufacturer: ONSemiconductor; Emitter- Base Voltage VEBO: 6V; Maximum Power Dissipation: 625mW; Maximum DC Collector Current: 0.2A; Collector- Emitter Voltage VCEO Max: 40V; Collector- Base Voltage VCBO: 60V; DC Collector/Base Gain hfe Min: 60; Configuration: Single; Collector-Emitter Saturation Voltage: 0.3V; Gain Bandwidth Product fT: 270MHz; Mounting Style: ThroughHole; Package / Case: TO-92-3(TO-226); Mounting Technology: ThroughHole; Minimum Operating Temperature: -65C; Datasheet Version: Rev. 8, 08/2012; Product Category: BipolarTransistors-BJT; Factory Pack Quantity: 5000; Transistor Polarity: NPN; Package Description: 3-Pin Transistor Outline, Body 4.825 x 3.685 mm, Pitch 1.27 mm; RoHS: Details; Datasheet URL: https://datasheet.ciiva.com/4725/2n3903-d-285841-4725808.pdf; Packaging: Bulk; Maximum Operating Temperature: +150C; Package Reference: TO-92-3-29-11; Brand: ONSemiconductor; Manufacturer URL: http://www.onsemi.com/
R22 R23 = CMP-1012-00510-1: as R3 on sheet MAIN; Technology: SMT; Tolerance: 1 %; Power: 0.1 W
R24 = CMP-1012-00623-1: as R10 on sheet MAIN; Power: 0.1 W; Tolerance: 1 %; Technology: SMT